# Altium schematic sheet FLASH.SchDoc
size A4
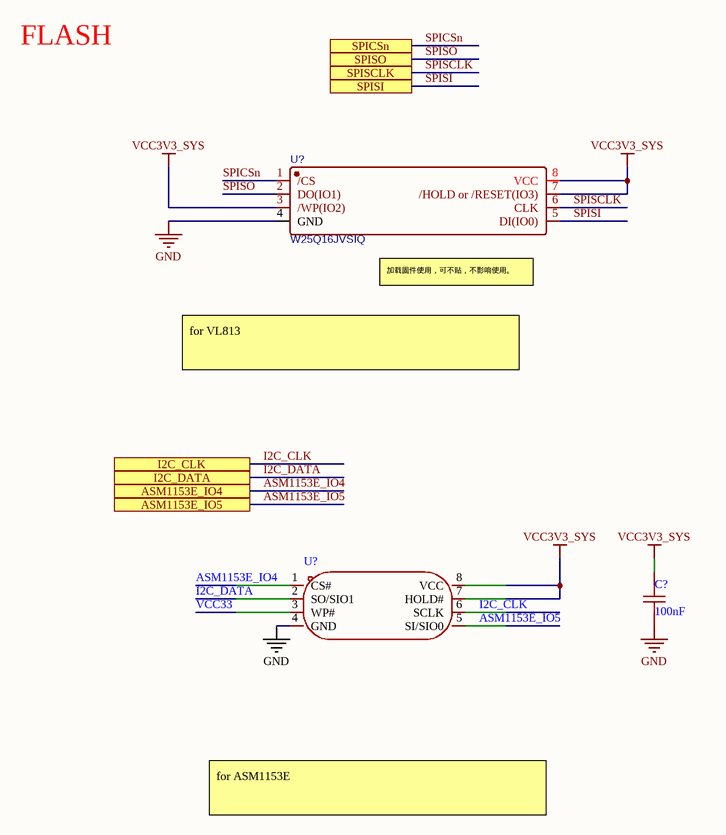
[diagram p0: FLASH.SchDoc]

## Parts
(Parts that share a designator on the sheet are numbered #1, #2 ... from top to bottom, then left to right.)
C?  100nF  [C0402]
U?#1  W25Q16JVSIQ  [SOIC-8_L5.3-W5.3-P1.27-LS8.0-BL]
U?#2  MX25L512EMI-10G  [SOP-8_L5.0-W4.0-P1.27-LS6.0-BL]  (value not drawn)

## Ports
ASM1153E_IO4, ASM1153E_IO5, I2C_CLK, I2C_DATA, SPICSn, SPISCLK, SPISI, SPISO

## Nets
GND: C?.2 U?#1.4(GND) U?#2.4(GND)
VCC3V3_SYS: C?.1 U?#1.3(/WP(IO2)) U?#1.7(/HOLD_or_/RESET(IO3)) U?#1.8(VCC) U?#2.7(HOLD#) U?#2.8(VCC)
ASM1153E_IO4: U?#2.1(CS#) ; port ASM1153E_IO4
ASM1153E_IO5: U?#2.5(SI/SIO0) ; port ASM1153E_IO5
I2C_CLK: U?#2.6(SCLK) ; port I2C_CLK
I2C_DATA: U?#2.2(SO/SIO1) ; port I2C_DATA
SPICSn: U?#1.1(/CS) ; port SPICSn
SPISCLK: U?#1.6(CLK) ; port SPISCLK
SPISI: U?#1.5(DI(IO0)) ; port SPISI
SPISO: U?#1.2(DO(IO1)) ; port SPISO
VCC33: U?#2.3(WP#)

## Notes on the sheet
- FLASH
- (near U?#1) 加载固件使用，可不贴，不影响使用。
- for VL813
- for ASM1153E

## Library data of the parts
C? = TCC0402X5R104M250AT: Manufacturer: CCTC(三环); Add into BOM: yes; Tolerance: ±20%; Voltage Rated: 25V; Temperature Coefficient: X5R; Symbol: TCC0402X5R104M250AT; Device: TCC0402X5R104M250AT; LCSC Part Name: 100nF ±20% 25V; Supplier Part: C359190; Manufacturer Part: TCC0402X5R104M250AT; Supplier Footprint: 0402; JLCPCB Part Class: Extended Part; Datasheet: https://atta.szlcsc.com/upload/public/pdf/source/20190103/C359190_40860758378AF13613616C0AB9EED028.pdf; Supplier: LCSC; Convert to PCB: yes; Value: 100nF
U?#1 = W25Q16FWSSIQ: BOM_Manufacturer: Winbond Elec; Contributor: LCSC; BOM_Supplier: LCSC; BOM_Supplier Part: C377629; BOM_Manufacturer Part: W25Q16FWSSIQ; BOM_JLCPCB Part Class: Extended Part; spicePre: U; spiceSymbolName: W25Q16FWSSIQ
U?#2 = MX25L512EMI-10G: Manufacturer: MXIC(旺宏电子); Symbol: MX25L512EMI-10G_C2803023; Add into BOM: yes; Device: MX25L512EMI-10G; LCSC Part Name: MX25L512EMI-10G; Supplier Part: C2803023; Manufacturer Part: MX25L512EMI-10G; Supplier Footprint: SOP-8; JLCPCB Part Class: Extended Part; Datasheet: https://atta.szlcsc.com/upload/public/pdf/source/20210906/B454D1B9C39ED3C00F3164A690CF7DD8.pdf; Supplier: LCSC; Convert to PCB: yes